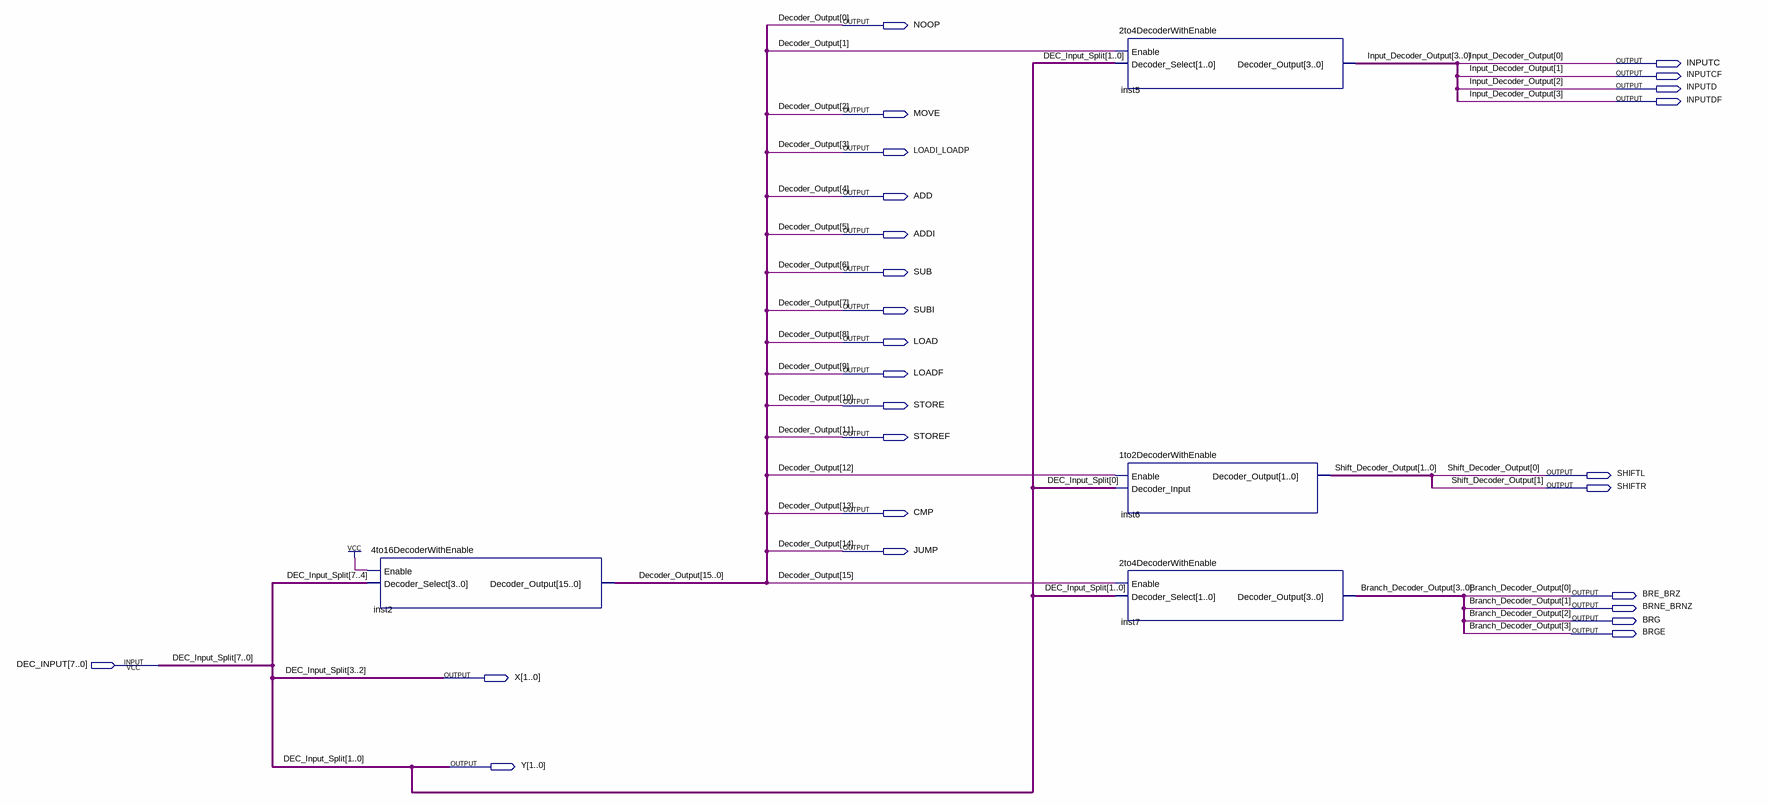
[diagram p0: schematic sheet]
// Quartus schematic Opcode_Decoder.bdf as structural Verilog: 4 symbols, 26 pins
module Opcode_Decoder (
  input  [7:0] DEC_INPUT,
  output NOOP,
  output INPUTC,
  output INPUTCF,
  output INPUTD,
  output INPUTDF,
  output MOVE,
  output LOADI_LOADP,
  output ADD,
  output ADDI,
  output SUB,
  output SUBI,
  output LOAD,
  output LOADF,
  output STORE,
  output STOREF,
  output SHIFTL,
  output SHIFTR,
  output CMP,
  output JUMP,
  output BRE_BRZ,
  output BRNE_BRNZ,
  output BRG,
  output BRGE,
  output [1:0] X,
  output [1:0] Y
);

  wire [15:1] Decoder_Output;

  \4to16DecoderWithEnable  inst2 (
    .Enable(1'b1), .Decoder_Select(DEC_INPUT[7:4]),
    .Decoder_Output({Decoder_Output[15], JUMP, CMP, Decoder_Output[12], STOREF, STORE, LOADF, LOAD, SUBI, SUB, ADDI, ADD, LOADI_LOADP, MOVE, Decoder_Output[1], NOOP}));
  \2to4DecoderWithEnable  inst5 (
    .Enable(Decoder_Output[1]), .Decoder_Select(DEC_INPUT[1:0]),
    .Decoder_Output({INPUTDF, INPUTD, INPUTCF, INPUTC}));
  \1to2DecoderWithEnable  inst6 (
    .Enable(Decoder_Output[12]), .Decoder_Input(DEC_INPUT[0]), .Decoder_Output({SHIFTR, SHIFTL}));
  \2to4DecoderWithEnable  inst7 (
    .Enable(Decoder_Output[15]), .Decoder_Select(DEC_INPUT[1:0]),
    .Decoder_Output({BRGE, BRG, BRNE_BRNZ, BRE_BRZ}));

  assign X = DEC_INPUT[3:2];
  assign Y = DEC_INPUT[1:0];

  // Other names for the same wires on the sheet: Branch_Decoder_Output[3:0] = {BRGE, BRG, BRNE_BRNZ, BRE_BRZ};
  //   DEC_Input_Split[7:0] = DEC_INPUT;
  //   Decoder_Output (some bits) = {JUMP, CMP, STOREF, STORE, LOADF, LOAD, SUBI, SUB, ADDI, ADD, LOADI_LOADP, MOVE, NOOP};
  //   Input_Decoder_Output[3:0] = {INPUTDF, INPUTD, INPUTCF, INPUTC}; Shift_Decoder_Output[1:0] = {SHIFTR, SHIFTL}
endmodule
